# EasyEDA schematic Proyecto DM.json
TITLE: Electronic Schematic; REV: 1.0; Date: 2022-09-04; Sheet: 1/1; Drawn By: Group 7; Company: Escuela Superior Politécnica del Litoral
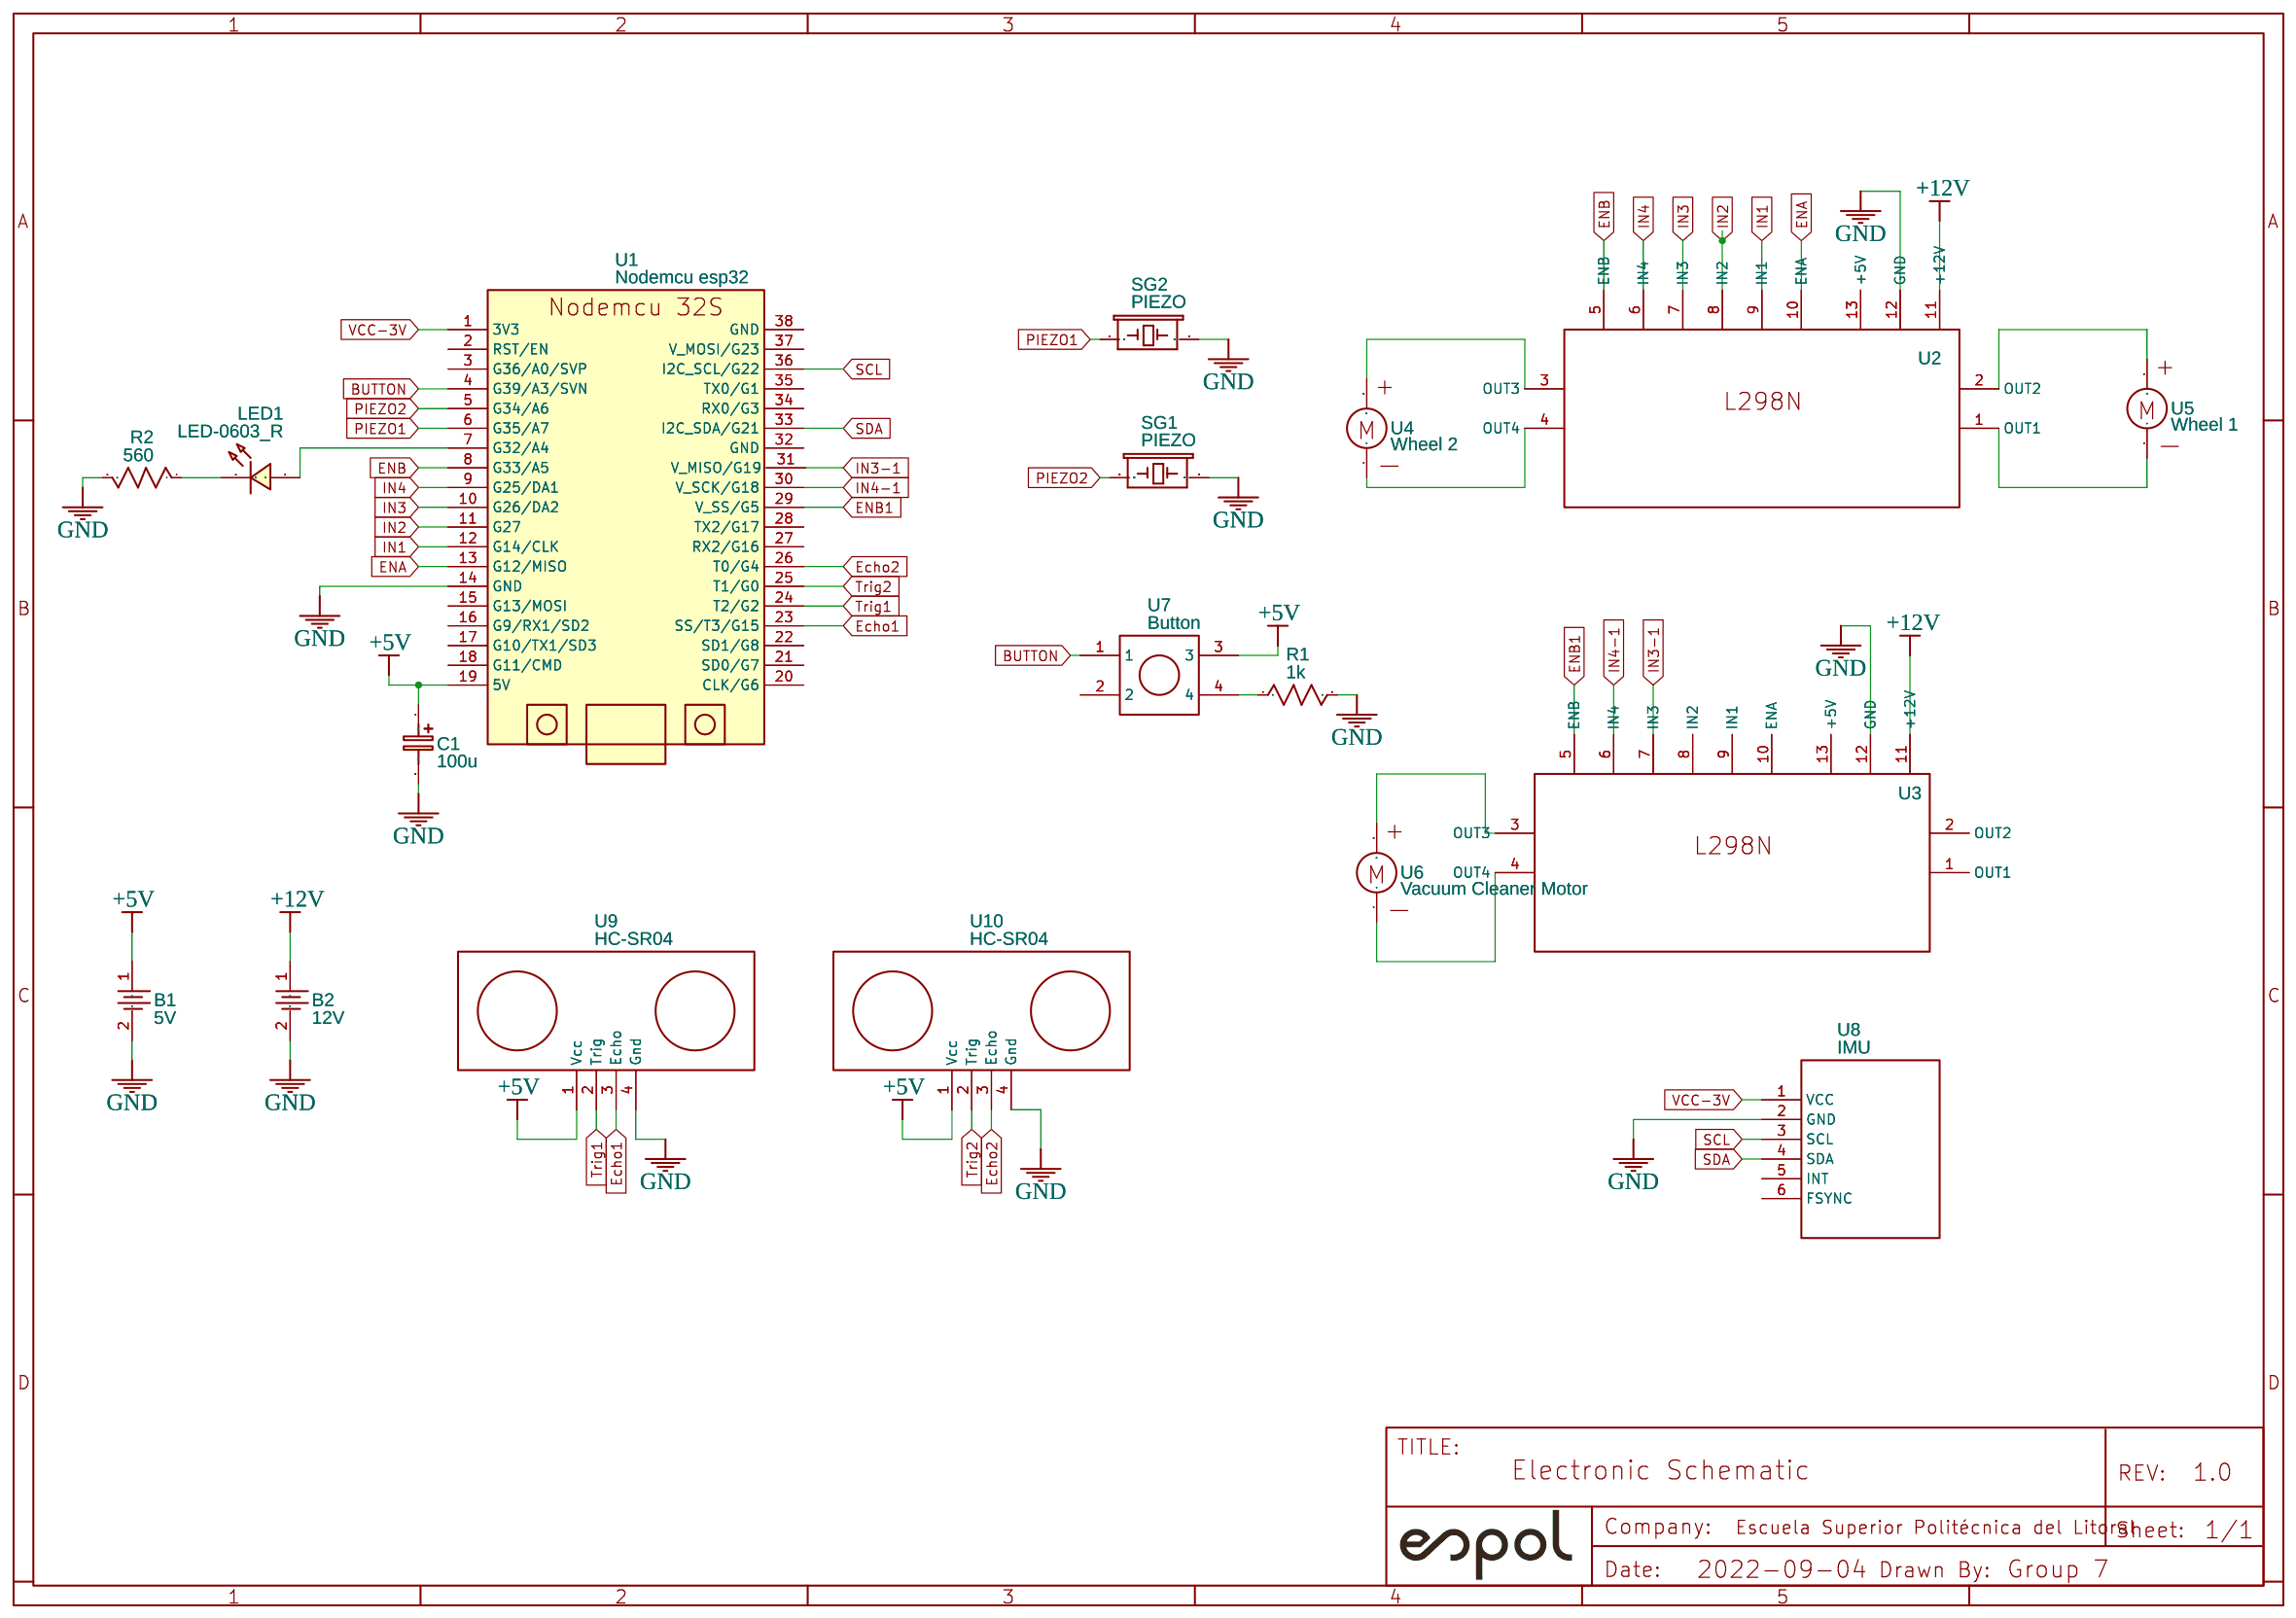
[diagram p0: schematic sheet]

## Parts
B1  5V  [BAT-SMD_CR1220-2]
B2  12V  [BAT-SMD_CR1220-2]
C1  100u  [CASE-A_3216]
LED1  LED-0603_R  [LED0603_RED]
R1  1k  [R0603]
R2  560  [R0603]
SG1  PIEZO  [PIEZO_14MM]
SG2  PIEZO  [PIEZO_14MM]
U1  Nodemcu esp32  [NODEMCU-ESP32S]
U2  L298N  [L298N]
U3  L298N  [L298N]
U4  Wheel 2  [TT DC MOTOR]
U5  Wheel 1  [TT DC MOTOR]
U6  Vacuum Cleaner Motor  [TT DC MOTOR]
U7  Button  [12X12 BUTTOM]
U8  IMU  [IMU_MODULE]
U9  HC-SR04  [HC-SR04]
U10  HC-SR04  [HC-SR04]

## Library data of the parts
B1 B2 = CR1220-2: Supplier: LCSC; Manufacturer: Q&J; image: //image.lceda.cn/szlcsc/C70381.jpg; Supplier Part: C70381
C1 = C_Tan_SMD_A_EU: Contributor: LCEDA_Lib
LED1 = LED-0603_R: Manufacturer: EVERLIGHT(台湾亿光); Manufacturer Part: 19-217/R6C-AL1M2VY/3T; Supplier Part: C72044; Supplier: LCSC; Contributor: LCEDA_01
R1 R2 = R_0603_US: Contributor: LCEDA_Lib
SG1 SG2 = PIEZO_14MM: Contributor: Ryan Carvalho
U1 = Nodemcu esp32: Contributor: peter.dantonio
U2 U3 = L298N: Contributor: omri325105
U4-U6 = DC Motor: Contributor: MARTINbucke
U7 = 12x12 Buttom: Contributor: Sukpradit
U8 = MPU9255 Modül: Contributor: ahmetceryan35
U9 U10 = HC-SR04: Contributor: Slowhand

## Nets
+5V: B1.1 C1.1 U1.19(5V) U7.3 U9.1(Vcc) U10.1(Vcc)
+12V: B2.1 U2.11(+12V) U3.11(+12V)
GND: B1.2 B2.2 C1.2 R1.2 R2.2 SG1.P$2 SG2.P$2 U1.14(GND) U2.12(GND) U3.12(GND) U8.2(GND) U9.4(Gnd) U10.4(Gnd)
VCC-3V: U1.1(3V3) U8.1(VCC)
BUTTON: U1.4(G39/A3/SVN) U7.1
Echo1: U1.23(SS/T3/G15) U9.3(Echo)
Echo2: U1.26(T0/G4) U10.3(Echo)
ENA: U1.13(G12/MISO) U2.10(ENA)
ENB: U1.8(G33/A5) U2.5(ENB)
ENB1: U1.29(V_SS/G5) U3.5(ENB)
IN1: U1.12(G14/CLK) U2.9(IN1)
IN2: U1.11(G27) U2.8(IN2)
IN3: U1.10(G26/DA2) U2.7(IN3)
IN3-1: U1.31(V_MISO/G19) U3.7(IN3)
IN4: U1.9(G25/DA1) U2.6(IN4)
IN4-1: U1.30(V_SCK/G18) U3.6(IN4)
PIEZO1: SG2.P$1 U1.6(G35/A7)
PIEZO2: SG1.P$1 U1.5(G34/A6)
SCL: U1.36(I2C SCL/G22) U8.3(SCL)
SDA: U1.33(I2C SDA/G21) U8.4(SDA)
Trig1: U1.24(T2/G2) U9.2(Trig)
Trig2: U1.25(T1/G0) U10.2(Trig)
Net-(LED1-1): LED1.1 U1.7(G32/A4)
Net-(LED1-2): LED1.2 R2.1
Net-(R1-1): R1.1 U7.4
Net-(U2-1): U2.1(OUT1) U5.1
Net-(U2-2): U2.2(OUT2) U5.2
Net-(U2-3): U2.3(OUT3) U4.2
Net-(U2-4): U2.4(OUT4) U4.1
Net-(U3-3): U3.3(OUT3) U6.2
Net-(U3-4): U3.4(OUT4) U6.1

Not connected (* = marked no-connect by the designer): U1 2(RST/EN) 3(G36/A0/SVP) 15(G13/MOSI) 16(G9/RX1/SD2) 17(G10/TX1/SD3) 18(G11/CMD) 20(CLK/G6) 21(SD0/G7) 22(SD1/G8) 27(RX2/G16) 28(TX2/G17) 32(GND) 34(RX0/G3) 35(TX0/G1) 37(V_MOSI/G23) 38(GND); U2 13(+5V); U3 1(OUT1) 2(OUT2) 8(IN2) 9(IN1) 10(ENA) 13(+5V); U7 2; U8 5(INT) 6(FSYNC)
